# EAGLE design Project Sch (EAGLE 7.5.0)
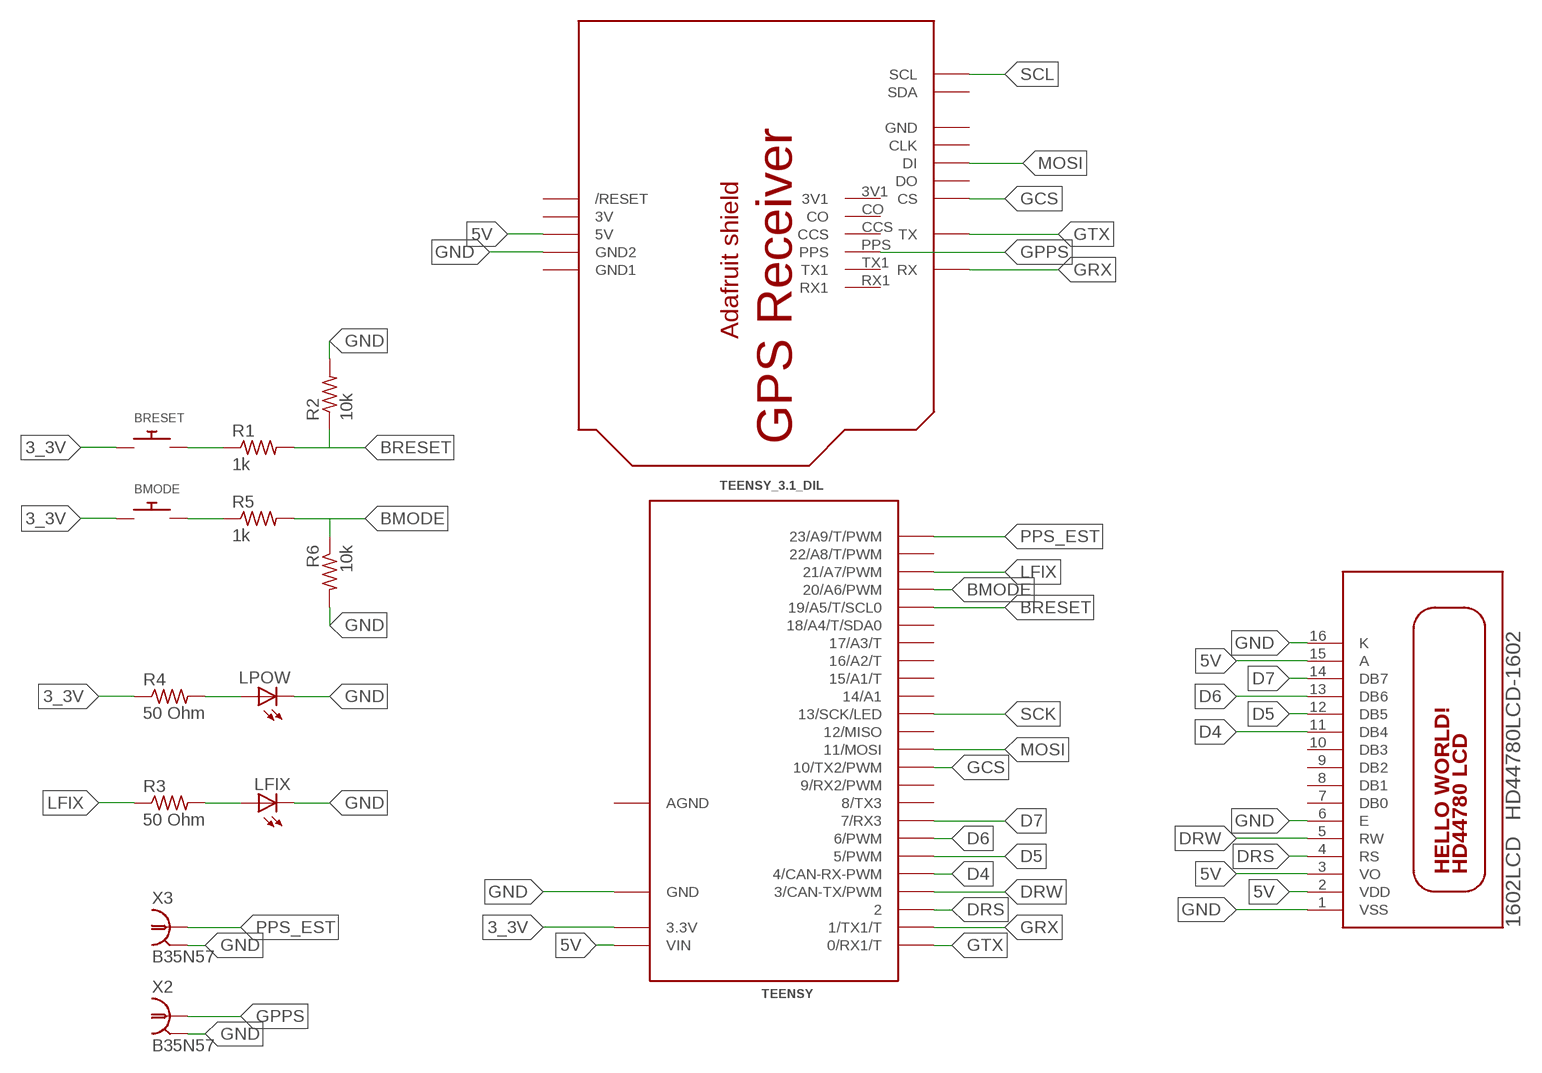
[diagram p0: schematic, sheet 1]

## Parts
1602LCD  HD44780LCD-1602  [LCD1602]
BMODE  SWITCH_PUSHBUTTONEVQ-PE  [TACT_PANA-EVQ]
BRESET  SWITCH_PUSHBUTTONEVQ-PE  [TACT_PANA-EVQ]
LFIX  LED3MM  [LED3MM]
LPOW  LED3MM  [LED3MM]
R1  1k  R-US_0204/7  [0204/7]
R2  10k  R-US_0204/7  [0204/7]
R3  50 Ohm  R-US_0204/7  [0204/7]
R4  50 Ohm  R-US_0204/7  [0204/7]
R5  1k  R-US_0204/7  [0204/7]
R6  10k  R-US_0204/7  [0204/7]
TEENSY  TEENSY_3.1_DIL  [TEENSY3-DIL]
U1  ADAFRUIT_GPS_SHIELD-DIMENSION  [ADAFRUIT_GPS_SHIELD]
X2  B35N57  [B35N57]
X3  B35N57  [B35N57]

## Nets
3_3V: BMODE.P$1 BRESET.P$1 R4.1 TEENSY.3.3V
5V: 1602LCD.2(VDD) 1602LCD.3(VO) 1602LCD.15(A) TEENSY.VIN U1.5V
BMODE: R5.2 R6.1 TEENSY.20/A6(20/A6/PWM)
BRESET: R1.2 R2.1 TEENSY.19/A5(19/A5/T/SCL0)
D4: 1602LCD.11(DB4) TEENSY.4(4/CAN-RX-PWM)
D5: 1602LCD.12(DB5) TEENSY.5(5/PWM)
D6: 1602LCD.13(DB6) TEENSY.6(6/PWM)
D7: 1602LCD.14(DB7) TEENSY.7(7/RX3)
DRS: 1602LCD.4(RS) TEENSY.2
DRW: 1602LCD.5(RW) TEENSY.3(3/CAN-TX/PWM)
GCS: TEENSY.10(10/TX2/PWM) U1.CS
GND: 1602LCD.1(VSS) 1602LCD.6(E) 1602LCD.16(K) LFIX.K(C) LPOW.K(C) R2.2 R6.2 TEENSY.GND U1.GND2 X2.2 X2.3 X2.4 X2.5 X3.2 X3.3 X3.4 X3.5
GPPS: U1.PPS X2.1
GRX: TEENSY.1(1/TX1/T) U1.RX
GTX: TEENSY.0(0/RX1/T) U1.TX
LFIX: R3.1 TEENSY.21/A7(21/A7/PWM)
MOSI: TEENSY.11(11/MOSI) U1.DI
N$1: BRESET.P$2 R1.1
N$3: BMODE.P$2 R5.1
N$4: LFIX.A R3.2
N$5: LPOW.A R4.2
PPS_EST: TEENSY.23/A9(23/A9/T/PWM) X3.1
SCK: TEENSY.13(13/SCK/LED)
SCL: U1.SCL
Unconnected: 1602LCD.7(DB0) 1602LCD.8(DB1) 1602LCD.9(DB2) 1602LCD.10(DB3) TEENSY.8(8/TX3) TEENSY.9(9/RX2/PWM) TEENSY.12(12/MISO) TEENSY.14/A0(14/A1) TEENSY.15/A1(15/A1/T) TEENSY.16/A2(16/A2/T) TEENSY.17/A3(17/A3/T) TEENSY.18/A4(18/A4/T/SDA0) TEENSY.22/A8(22/A8/T/PWM) U1.3V1 U1./RESET U1.CCS U1.CLK U1.CO U1.DO U1.RX1 U1.SDA U1.TX1

## Power pins joined to a net without a drawn wire
3V: U1.3V
AGND: TEENSY.AGND
GND: U1.GND
GND1: U1.GND1

## Library data of the parts
1602LCD = adafruit:HD44780LCD: HD44780 LCD Standard character type LCDs, available in sizes from 8x1 to 40x4!
BMODE BRESET = adafruit:SWITCH_PUSHBUTTON: Buttons SOFTTOUCHSMD_SJ - Soft touch temporary push button (Super Junk Akihabara) Compatible with SKPMANE010 [Mouser: 688-SKPMAN] C&K_KSS = Digikey: KSS221GLFS
LFIX LPOW = adafruit:LED: LED OSRAM: - CHIPLED LG R971, LG N971, LY N971, LG Q971, LY Q971, LO R971, LY R971 LH N974, LH R974 LS Q976, LO Q976, LY Q976 LO Q996 - Hyper CHIPLED LW Q18S LB Q993, LB Q99A, LB R99A - SideLED LS A670, LO A670, LY A670, LG A670, LP A670 LB A673, LV A673, LT A673, LW A673 LH A674 LY A675 LS A676, LA A676, LO A676, LY A676, LW A676 LS A679, LY A679, LG A679 - Hyper Micro SIDELED® LS Y876, LA Y876, LO Y876, LY Y876 LT Y87S - SmartLED LW L88C, LW L88S LB L89C, LB L89S, LG L890 LS L89K, LO L89K, LY L89K LS L896, LA L896, LO L896, LY L896 - TOPLED LS T670, LO T670, LY T670, LG T670, LP T670 LSG T670, LSP T670, LSY T670, LOP T670, LYG T670 LG T671, LOG T671, LSG T671 LB T673, LV T673, LT T673, LW T673 LH T674 LS T676, LA T676, LO T676, LY T676, LB T676, LH T676, LSB T676, LW T676 LB T67C, LV T67C, LT T67C, LS T67K, LO T67K, LY T67K, LW E67C LS E67B, LA E67B, LO E67B, LY E67B, LB E67C, LV E67C, LT E67C LW T67C LS T679, LY T679, LG T679 LS T770, LO T770, LY T770, LG T770, LP T770 LB T773, LV T773, LT T773, LW T773 LH T774 LS E675, LA E675, LY E675, LS T675 LS T776, LA T776, LO T776, LY T776, LB T776 LHGB T686 LT T68C, LB T68C - Hyper Mini TOPLED® LB M676 - Mini TOPLED Santana® LG M470 LS M47K, LO M47K, LY M47K Source: http://www.osram.convergy.de/
R1-R6 = adafruit:R-US_: RESISTOR, American symbol
TEENSY = Teensy_3_and_LC_Series_Boards_v1.1:TEENSY_3.1_DIL: Teensy 3.1 or 3.2 in a DIL Layout.
U1 = AdafruitGPS:ADAFRUIT_GPS_SHIELD: This is the Adafruit GPS logger shield
X2 X3 = con-coax:B35N57: BNC CONNECTOR M/A COM www.macom.com; OC_FARNELL: unknown; OC_NEWARK: unknown

## Board
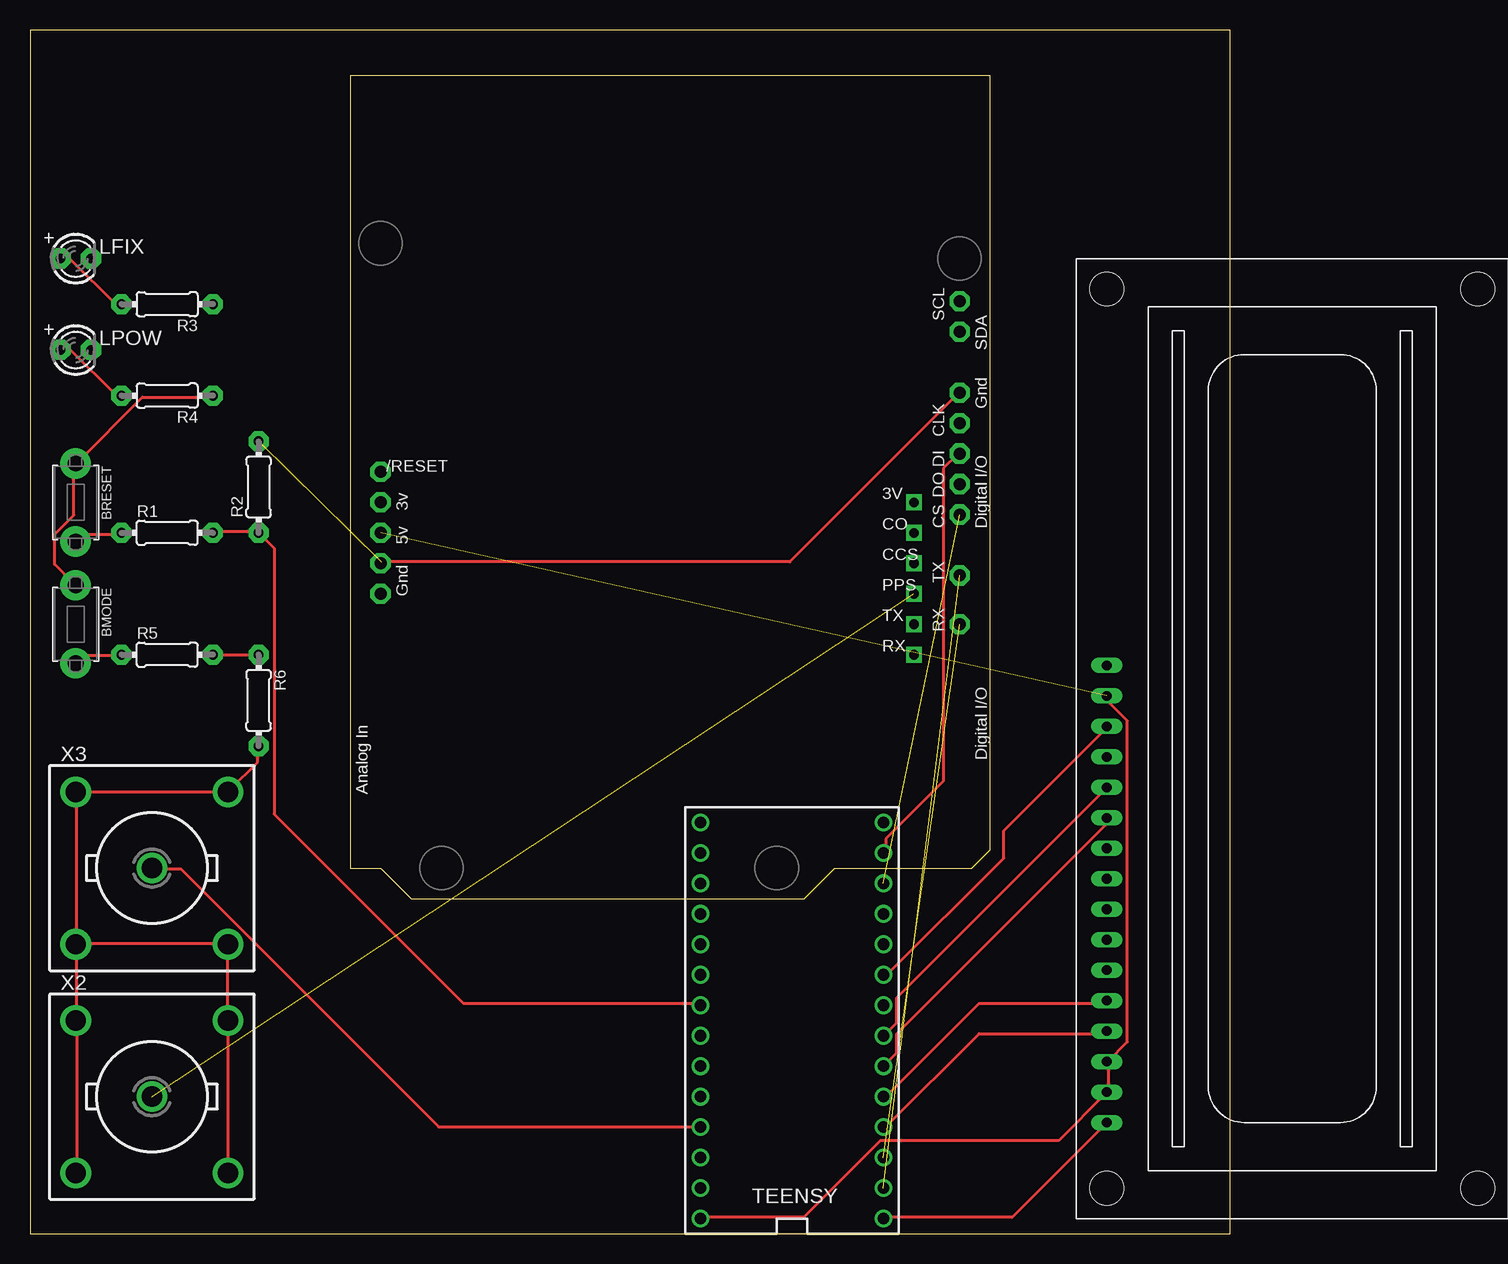
[diagram p1: board, top side]
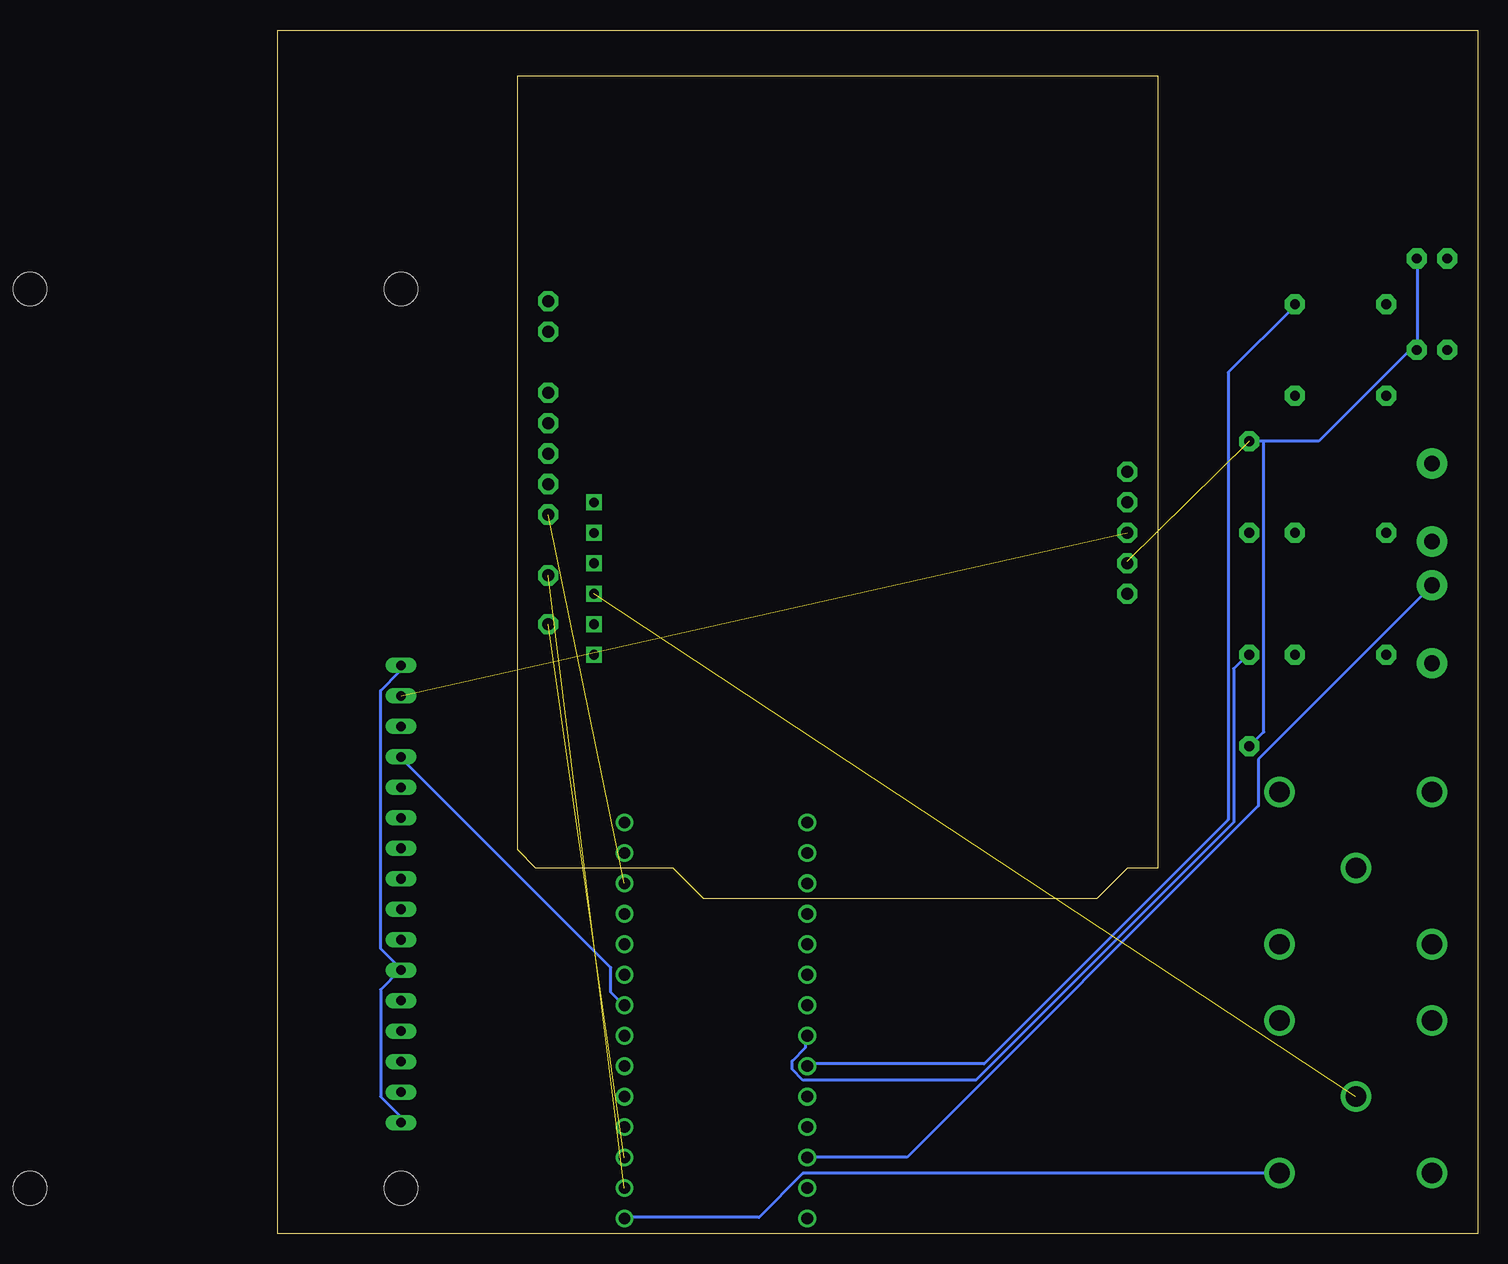
[diagram p2: board, bottom side, seen from below]

Size 100 x 100.32 mm. Coordinates in mm from the lower left corner, seen from the top.
Outline: 0,0 100,0 100,100.32 0,100.32 0,0
Copper layers (1*16): Top 0.035mm / dielectric 1.5mm / Bottom 0.035mm
Design rules "default": minimum track width 10mil, minimum drill 24mil, track to track 8mil, track to pad 8mil, pad to pad 8mil, via to via 8mil, smd to smd 8mil, copper to edge 40mil, drill to drill 8mil, minimum pad ring 10mil, minimum via ring 8mil, stop-mask expansion 4mil, vias tented up to drill 0mil, thermal gap 10mil

### Footprints (pad centres in the part's own frame; a part is rotated, then mirrored left to right if it is on the bottom)
LCD1602 = drill 0.8 long: 1 8,33.46; 2 10.54,33.46; 3 13.08,33.46; 4 15.62,33.46; 5 18.16,33.46; 6 20.7,33.46; 7 23.24,33.46; 8 25.78,33.46; 9 28.32,33.46; 10 30.86,33.46; 11 33.4,33.46; 12 35.94,33.46; 13 38.48,33.46; 14 41.02,33.46; 15 43.56,33.46; 16 46.1,33.46 | hole 2.8: 2.54,2.54; 2.54,33.46; 77.46,33.46; 77.46,2.54
TACT_PANA-EVQ = drill 1.3 pad 2.54: P$1 -3.25,0; P$2 3.25,0
LED3MM = drill 0.813 pad 1.676 octagon: A -1.27,0; K 1.27,0
0204/7 = drill 0.813 pad 1.676 octagon: 1 -3.81,0; 2 3.81,0
TEENSY3-DIL = drill 0.965: 0 -7.62,13.97; 1 -7.62,11.43; 2 -7.62,8.89; 3 -7.62,6.35; 3.3V 7.62,11.43; 4 -7.62,3.81; 5 -7.62,1.27; 6 -7.62,-1.27; 7 -7.62,-3.81; 8 -7.62,-6.35; 9 -7.62,-8.89; 10 -7.62,-11.43; 11 -7.62,-13.97; 12 -7.62,-16.51; 13 7.62,-16.51; 14/A0 7.62,-13.97; 15/A1 7.62,-11.43; 16/A2 7.62,-8.89; 17/A3 7.62,-6.35; 18/A4 7.62,-3.81; 19/A5 7.62,-1.27; 20/A6 7.62,1.27; 21/A7 7.62,3.81; 22/A8 7.62,6.35; 23/A9 7.62,8.89; AGND 7.62,13.97; GND -7.62,16.51; VIN 7.62,16.51
ADAFRUIT_GPS_SHIELD = drill 1 pad 1.676 octagon: 3V 35.56,2.54; 5V 38.1,2.54; /RESET 33.02,2.54; CLK 28.956,50.8; CS 36.576,50.8; DI 31.496,50.8; DO 34.036,50.8; GND 26.416,50.8; GND1 43.18,2.54; GND2 40.64,2.54; RX 45.72,50.8; SCL 18.796,50.8; SDA 21.336,50.8; TX 41.656,50.8 | drill 0.8 square: 3V1 35.56,46.99; CCS 40.64,46.99; CO 38.1,46.99; PPS 43.18,46.99; RX1 48.26,46.99; TX1 45.72,46.99
B35N57 = drill 1.7: 1 0,0; 2 6.35,6.35; 3 -6.35,6.35; 4 -6.35,-6.35; 5 6.35,-6.35

### Placement (x,y rotation side)
1602LCD  123.19,1.27 90 top
BMODE  3.81,50.8 270 top
BRESET  3.81,60.96 270 top
LFIX  3.81,81.28 0 top
LPOW  3.81,73.66 0 top
R1  11.43,58.42 0 top
R2  19.05,62.23 90 top
R3  11.43,77.47 180 top
R4  11.43,69.85 180 top
R5  11.43,48.26 0 top
R6  19.05,44.45 270 top
TEENSY  63.5,17.78 180 top
U1  26.67,96.52 270 top
X2  10.16,11.43 0 top
X3  10.16,30.48 0 top

### Tracks (layer width: path | path; a pad name or v marks a point on that pad's centre or on a via)
3_3V
  Top 0.254: R4.1 15.09,69.72 9.37,69.72 3.89,64.24 BRESET.P$1 3.66,64.01 3.66,59.89 2.06,58.29 2.06,55.78 3.66,54.18 BMODE.P$1
  Bottom 0.254: TEENSY.3.3V 55.78,6.4 47.55,6.4 18.29,35.66 18.29,39.55 3.89,53.95 BMODE.P$1
5V  (1 unrouted)
  Top 0.254: 1602LCD.15 89.84,44.81 89.84,44.35 91.44,42.75 91.44,16 89.84,14.4 1602LCD.3 89.84,14.17 89.84,11.89 1602LCD.2 89.61,11.66 85.72,7.77 70.87,7.77 64.47,1.37 56.01,1.37 TEENSY.VIN
BMODE
  Top 0.254: R5.2 15.32,48.23 18.97,48.23 R6.1
  Bottom 0.254: TEENSY.20/A6 56.01,16.46 56.01,15.54 57.15,14.4 57.15,13.72 56.24,12.8 41.83,12.8 20.34,34.29 20.34,47.09 19.2,48.23 R6.1
BRESET
  Top 0.254: TEENSY.19/A5 55.78,19.2 36.12,19.2 20.34,34.98 20.34,57.15 19.2,58.29 R2.1 18.97,58.52 15.32,58.52 R1.2
D4
  Top 0.254: TEENSY.4 72.24,15.09 72.24,16.69 89.61,34.06 89.61,34.52 1602LCD.11
D5
  Top 0.254: 1602LCD.12 89.61,37.03 72.24,19.66 72.24,17.6 71.32,16.69 TEENSY.5
D6
  Bottom 0.254: 1602LCD.13 89.61,39.55 72.24,22.17 72.24,20.12 71.32,19.2 TEENSY.6
D7
  Top 0.254: 1602LCD.14 89.61,42.06 81.15,33.6 81.15,31.32 71.32,21.49 TEENSY.7
DRS
  Top 0.254: 1602LCD.4 89.61,16.69 79.1,16.69 71.32,8.91 TEENSY.2
DRW
  Top 0.254: 1602LCD.5 89.61,19.2 79.1,19.2 71.32,11.43 TEENSY.3
GCS  (1 unrouted)
GND  (1 unrouted)
  Top 0.254: TEENSY.GND 71.32,1.37 81.84,1.37 89.61,9.14 1602LCD.1 | X2.5 16.46,5.26 16.46,17.6 X2.2 16.46,17.83 16.46,24 X3.5 16.46,24.23 3.89,24.23 | R6.2 18.97,40.46 18.97,39.32 16.69,37.03 X3.2 16.46,36.8 3.89,36.8 | X2.4 3.89,5.26 3.89,17.6 X2.3 3.89,17.83 3.89,24 X3.4 3.89,24.23 | 3.89,24.23 3.89,36.8 | 3.89,36.8 X3.3 | U1.GND2 29.26,56.01 63.32,56.01 77.27,69.95 U1.GND
  Bottom 0.254: 1602LCD.1 89.84,9.37 89.84,9.83 91.44,11.43 91.44,20.34 89.84,21.95 1602LCD.6 89.84,22.17 91.44,23.77 91.44,45.26 89.84,46.86 89.84,47.32 1602LCD.16 | LFIX.K 5.03,81.15 5.03,73.84 LPOW.K 5.26,73.61 5.71,73.61 13.26,66.06 17.83,66.06 | 17.83,66.06 18.97,66.06 R2.2 | 17.83,66.06 17.83,41.83 18.97,40.69 R6.2 | TEENSY.GND 71.09,1.37 59.89,1.37 56.24,5.03 16.69,5.03 X2.5
GPPS  (1 unrouted)
GRX  (1 unrouted)
GTX  (1 unrouted)
LFIX
  Bottom 0.254: TEENSY.21/A7 55.78,14.17 41.15,14.17 20.8,34.52 20.8,71.78 15.32,77.27 R3.1
MOSI
  Top 0.254: TEENSY.11 71.32,31.77 71.32,32.92 76.12,37.72 76.12,63.78 77.27,64.92 U1.DI
N$1
  Top 0.254: R1.1 7.54,58.29 4.34,58.29 3.89,57.84 BRESET.P$2
N$3
  Top 0.254: R5.1 7.54,48.23 4.34,48.23 3.89,47.78 BMODE.P$2
N$4
  Top 0.254: LFIX.A 2.74,81.15 3.43,81.15 7.09,77.5 7.54,77.5 R3.2
N$5
  Top 0.254: LPOW.A 2.74,73.61 3.43,73.61 7.09,69.95 7.54,69.95 R4.2
PPS_EST
  Top 0.254: TEENSY.23/A9 55.78,8.91 34.06,8.91 12.57,30.4 10.29,30.4 X3.1